# Altium schematic sheet Power Supply.SchDoc
size A; SheetNumber: 3; SheetTotal: 4
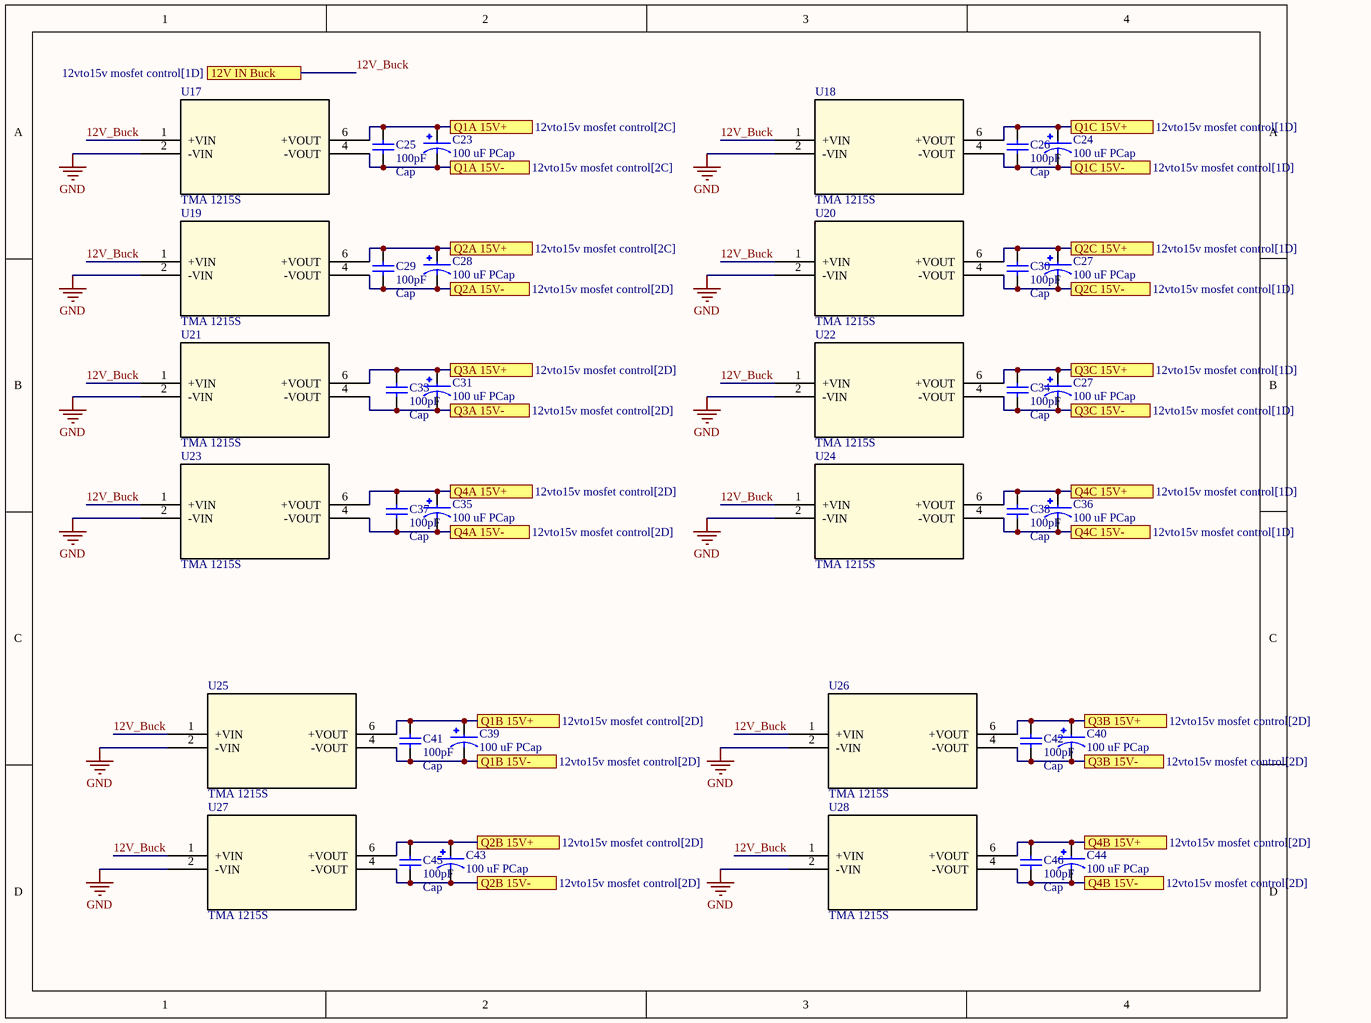
[diagram p0: Power Supply.SchDoc]

## Parts
(Parts that share a designator on the sheet are numbered #1, #2 ... from top to bottom, then left to right.)
C23  100 uF PCap  [100uF PCap]
C24  100 uF PCap  [100uF PCap]
C25  Cap  value 100pF  [RAD-0.3]
C26  Cap  value 100pF  [RAD-0.3]
C27#1  100 uF PCap  [100uF PCap]
C27#2  100 uF PCap  [100uF PCap]
C28  100 uF PCap  [100uF PCap]
C29  Cap  value 100pF  [RAD-0.3]
C30  Cap  value 100pF  [RAD-0.3]
C31  100 uF PCap  [100uF PCap]
C33  Cap  value 100pF  [RAD-0.3]
C34  Cap  value 100pF  [RAD-0.3]
C35  100 uF PCap  [100uF PCap]
C36  100 uF PCap  [100uF PCap]
C37  Cap  value 100pF  [RAD-0.3]
C38  Cap  value 100pF  [RAD-0.3]
C39  100 uF PCap  [100uF PCap]
C40  100 uF PCap  [100uF PCap]
C41  Cap  value 100pF  [RAD-0.3]
C42  Cap  value 100pF  [RAD-0.3]
C43  100 uF PCap  [100uF PCap]
C44  100 uF PCap  [100uF PCap]
C45  Cap  value 100pF  [RAD-0.3]
C46  Cap  value 100pF  [RAD-0.3]
U17  TMA 1215S  [TMA SINGLE_TRP]
U18  TMA 1215S  [TMA SINGLE_TRP]
U19  TMA 1215S  [TMA SINGLE_TRP]
U20  TMA 1215S  [TMA SINGLE_TRP]
U21  TMA 1215S  [TMA SINGLE_TRP]
U22  TMA 1215S  [TMA SINGLE_TRP]
U23  TMA 1215S  [TMA SINGLE_TRP]
U24  TMA 1215S  [TMA SINGLE_TRP]
U25  TMA 1215S  [TMA SINGLE_TRP]
U26  TMA 1215S  [TMA SINGLE_TRP]
U27  TMA 1215S  [TMA SINGLE_TRP]
U28  TMA 1215S  [TMA SINGLE_TRP]

## Ports
12V IN Buck (see 12vto15v mosfet control[1D]), Q1A 15V+ (see 12vto15v mosfet control[2C]), Q1A 15V- (see 12vto15v mosfet control[2C]), Q1B 15V+ (see 12vto15v mosfet control[2D]), Q1B 15V- (see 12vto15v mosfet control[2D]), Q1C 15V+ (see 12vto15v mosfet control[1D]), Q1C 15V- (see 12vto15v mosfet control[1D]), Q2A 15V+ (see 12vto15v mosfet control[2C]), Q2A 15V- (see 12vto15v mosfet control[2D]), Q2B 15V+ (see 12vto15v mosfet control[2D]), Q2B 15V- (see 12vto15v mosfet control[2D]), Q2C 15V+ (see 12vto15v mosfet control[1D]), Q2C 15V- (see 12vto15v mosfet control[1D]), Q3A 15V+ (see 12vto15v mosfet control[2D]), Q3A 15V- (see 12vto15v mosfet control[2D]), Q3B 15V+ (see 12vto15v mosfet control[2D]), Q3B 15V- (see 12vto15v mosfet control[2D]), Q3C 15V+ (see 12vto15v mosfet control[1D]), Q3C 15V- (see 12vto15v mosfet control[1D]), Q4A 15V+ (see 12vto15v mosfet control[2D]), Q4A 15V- (see 12vto15v mosfet control[2D]), Q4B 15V+ (see 12vto15v mosfet control[2D]), Q4B 15V- (see 12vto15v mosfet control[2D]), Q4C 15V+ (see 12vto15v mosfet control[1D]), Q4C 15V- (see 12vto15v mosfet control[1D])

## Nets
GND: U17.2(-VIN) U18.2(-VIN) U19.2(-VIN) U20.2(-VIN) U21.2(-VIN) U22.2(-VIN) U23.2(-VIN) U24.2(-VIN) U25.2(-VIN) U26.2(-VIN) U27.2(-VIN) U28.2(-VIN)
12V_Buck: U17.1(+VIN) U18.1(+VIN) U19.1(+VIN) U20.1(+VIN) U21.1(+VIN) U22.1(+VIN) U23.1(+VIN) U24.1(+VIN) U25.1(+VIN) U26.1(+VIN) U27.1(+VIN) U28.1(+VIN) ; port 12V IN Buck
Q1A 15V+: C23.P C25.1 U17.6(+VOUT) ; port Q1A 15V+
Q1A 15V-: C23.N C25.2 U17.4(-VOUT) ; port Q1A 15V-
Q1B 15V+: C39.P C41.2 U25.6(+VOUT) ; port Q1B 15V+
Q1B 15V-: C39.N C41.1 U25.4(-VOUT) ; port Q1B 15V-
Q1C 15V+: C24.P C26.2 U18.6(+VOUT) ; port Q1C 15V+
Q1C 15V-: C24.N C26.1 U18.4(-VOUT) ; port Q1C 15V-
Q2A 15V+: C28.P C29.2 U19.6(+VOUT) ; port Q2A 15V+
Q2A 15V-: C28.N C29.1 U19.4(-VOUT) ; port Q2A 15V-
Q2B 15V+: C43.P C45.2 U27.6(+VOUT) ; port Q2B 15V+
Q2B 15V-: C43.N C45.1 U27.4(-VOUT) ; port Q2B 15V-
Q2C 15V+: C27#1.P C30.2 U20.6(+VOUT) ; port Q2C 15V+
Q2C 15V-: C27#1.N C30.1 U20.4(-VOUT) ; port Q2C 15V-
Q3A 15V+: C31.P C33.2 U21.6(+VOUT) ; port Q3A 15V+
Q3A 15V-: C31.N C33.1 U21.4(-VOUT) ; port Q3A 15V-
Q3B 15V+: C40.P C42.2 U26.6(+VOUT) ; port Q3B 15V+
Q3B 15V-: C40.N C42.1 U26.4(-VOUT) ; port Q3B 15V-
Q3C 15V+: C27#2.P C34.2 U22.6(+VOUT) ; port Q3C 15V+
Q3C 15V-: C27#2.N C34.1 U22.4(-VOUT) ; port Q3C 15V-
Q4A 15V+: C35.P C37.2 U23.6(+VOUT) ; port Q4A 15V+
Q4A 15V-: C35.N C37.1 U23.4(-VOUT) ; port Q4A 15V-
Q4B 15V+: C44.P C46.2 U28.6(+VOUT) ; port Q4B 15V+
Q4B 15V-: C44.N C46.1 U28.4(-VOUT) ; port Q4B 15V-
Q4C 15V+: C36.P C38.2 U24.6(+VOUT) ; port Q4C 15V+
Q4C 15V-: C36.N C38.1 U24.4(-VOUT) ; port Q4C 15V-

## Library data of the parts
C23 C24 C27#1 C27#2 C28 C31 C35 C36 C39 C40 C43 C44 = 100 uF PCap: Capacitor; Aluminum Electrolytic; Radial Al Electrolytic Cap; 100uF 63V; MF: Panasonic Electronic; MP: EEU-FC1J101; Package: RADIAL-2 Panasonic; Price: None; Check_prices: https://www.snapeda.com/parts/EEU-FC1J101/Panasonic%20Electronic%20Components/view-part/494707/?ref=eda; Value: *; SnapEDA_Link: https://www.snapeda.com/parts/EEU-FC1J101/Panasonic%20Electronic%20Components/view-part/494707/?ref=snap; Availability: In Stock
C25 C26 C29 C30 C33 C34 C37 C38 C41 C42 C45 C46 = Cap: Capacitor; Published: 8-Jun-2000; LatestRevisionDate: 17-Jul-2002; LatestRevisionNote: Re-released for DXP Platform.; PackageReference: RAD-0.3; Publisher: Altium Limited; PackageDescription: Radial Cap, Thru-Hole; 2 Leads; 0.3 in Pin Spacing
U17-U28 = TMA 1215S: No Description Available; Mfr_Name: Traco Power; RefDes: RefDes; Type: Type